# EAGLE design SXEGS (EAGLE 7.7.0)
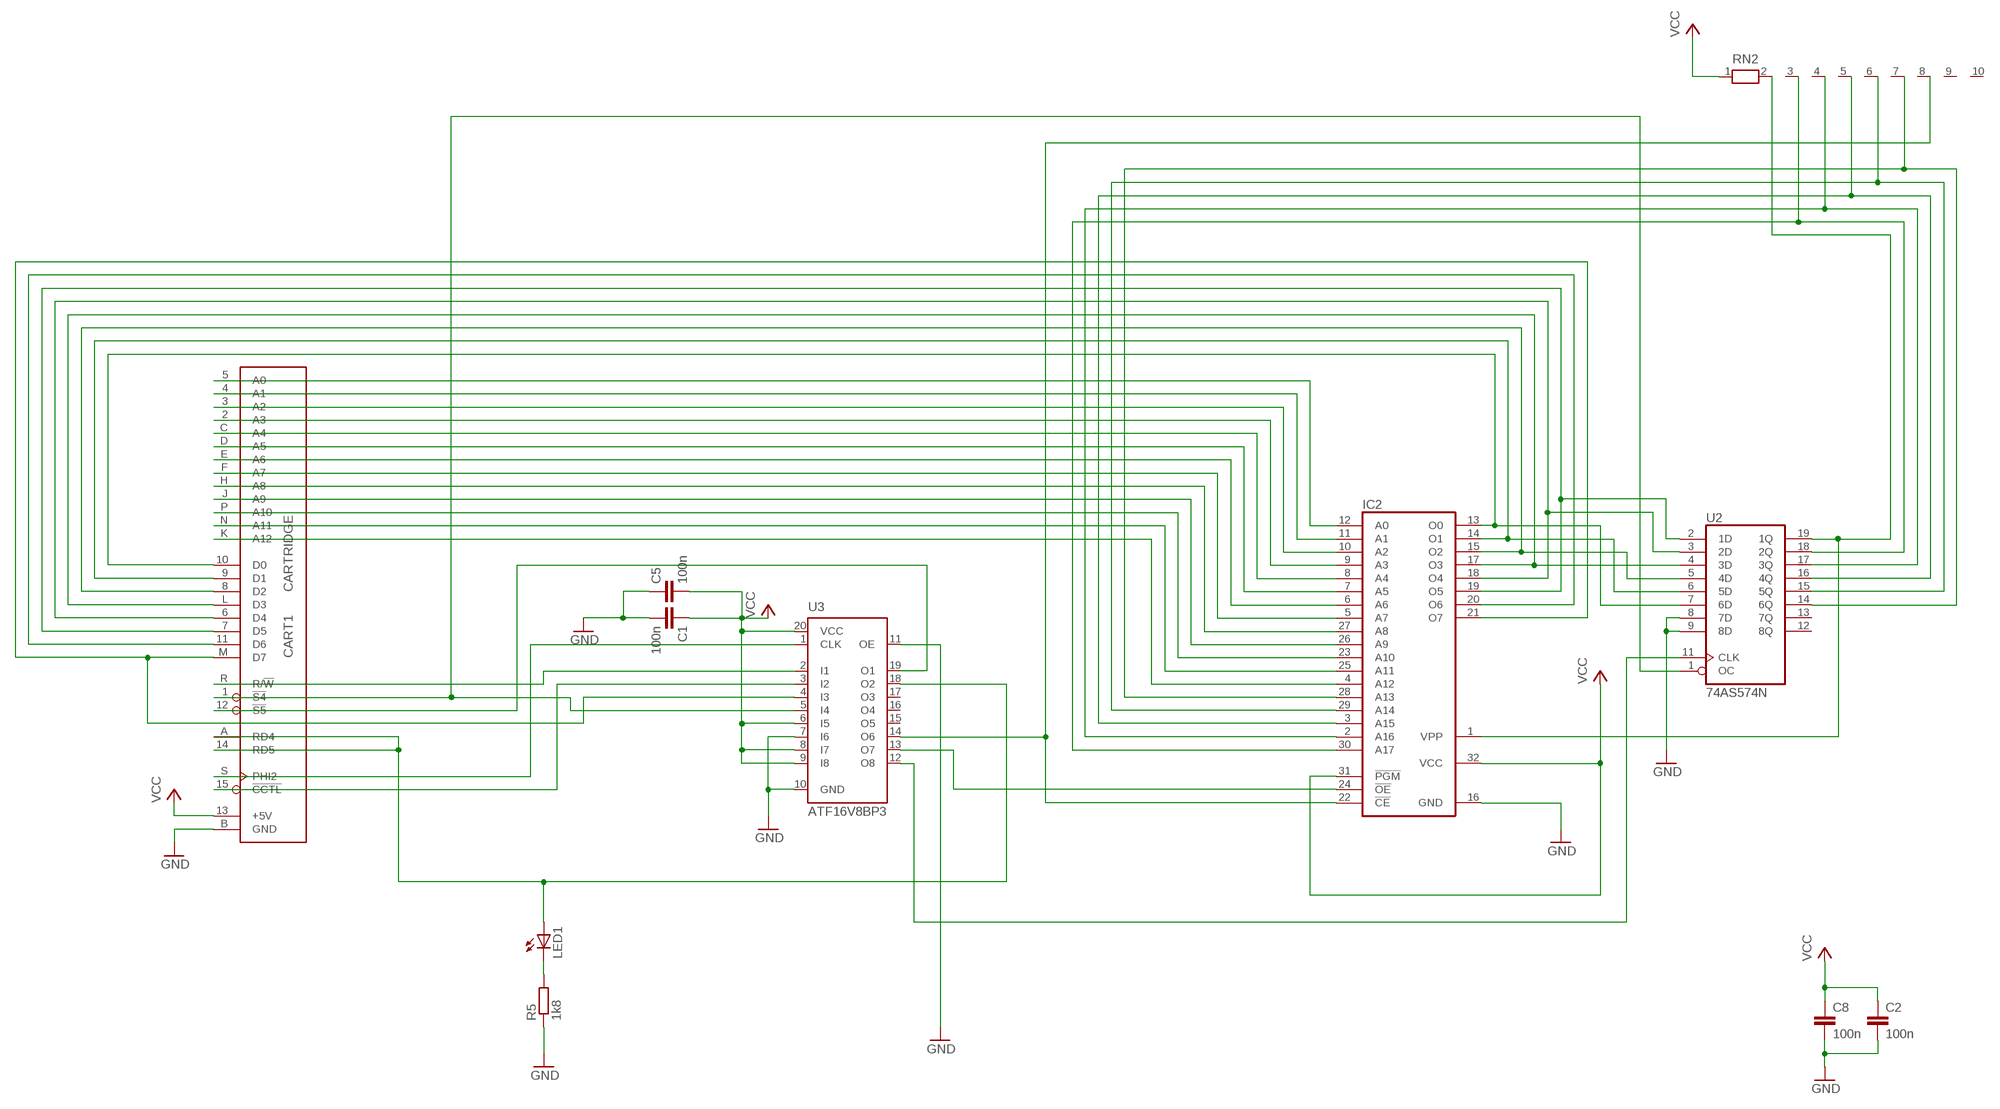
[diagram p0: schematic, sheet 1]

## Parts
C1  100n  C-EU050-024X044  [C050-024X044]
C2  100n  C-EUC0805  [C0805]
C5  100n  C-EUC0805  [C0805]
C8  100n  C-EUC0805  [C0805]
CART1  CARTRIDGE  [CARTRIDGE]
IC2  27C2001D  [DIL32]
LED1  LEDCHIP-LED0805  [CHIP-LED0805]
R5  1k8  R-EU_R0805  [R0805]
RN2  RN09  [RN-10]
U2  74AS574N  [DIL20]
U3  ATF16V8BP3  [DIL20]

## Nets
GND: C1.2 C2.2 C5.1 C8.2 CART1.B(GND) IC2.16(GND) R5.1 U2.8(7D) U2.9(8D) U3.7(I6) U3.10(GND) U3.11(OE)
N$1: LED1.C R5.2
N$3: IC2.30(A17) RN2.3 U2.18(2Q)
N$4: CART1.R(R/!W) U3.2(I1)
N$5: CART1.14(RD5) CART1.A(RD4) LED1.A U3.18(O2)
N$6: IC2.1(VPP) RN2.2 U2.19(1Q)
N$10: CART1.15(!CCTL) U3.3(I2)
N$11: CART1.S(PHI2) U3.1(CLK)
N$12: CART1.1(!S4) U2.1(OC) U3.5(I4)
N$13: CART1.12(!S5) U3.19(O1)
N$15: IC2.22(!CE) RN2.8 U3.14(O6)
N$16: IC2.24(!OE) U3.13(O7)
N$17: U2.11(CLK) U3.12(O8)
N$21: CART1.10(D0) IC2.13(O0) U2.7(6D)
N$22: CART1.9(D1) IC2.14(O1) U2.6(5D)
N$23: CART1.8(D2) IC2.15(O2) U2.5(4D)
N$24: CART1.L(D3) IC2.17(O3) U2.4(3D)
N$25: CART1.6(D4) IC2.18(O4) U2.3(2D)
N$26: CART1.7(D5) IC2.19(O5) U2.2(1D)
N$27: CART1.11(D6) IC2.20(O6)
N$28: CART1.M(D7) IC2.21(O7) U3.4(I3)
N$29: CART1.5(A0) IC2.12(A0)
N$30: CART1.4(A1) IC2.11(A1)
N$31: CART1.3(A2) IC2.10(A2)
N$32: CART1.2(A3) IC2.9(A3)
N$33: CART1.C(A4) IC2.8(A4)
N$34: CART1.D(A5) IC2.7(A5)
N$35: CART1.E(A6) IC2.6(A6)
N$36: CART1.F(A7) IC2.5(A7)
N$37: CART1.H(A8) IC2.27(A8)
N$38: CART1.J(A9) IC2.26(A9)
N$39: CART1.P(A10) IC2.23(A10)
N$40: CART1.N(A11) IC2.25(A11)
N$41: CART1.K(A12) IC2.4(A12)
N$42: IC2.28(A13) RN2.7 U2.14(6Q)
N$44: IC2.29(A14) RN2.6 U2.15(5Q)
N$45: IC2.3(A15) RN2.5 U2.16(4Q)
N$46: IC2.2(A16) RN2.4 U2.17(3Q)
VCC: C1.1 C2.1 C5.2 C8.1 CART1.13(+5V) IC2.31(!PGM) RN2.1 U3.6(I5) U3.8(I7) U3.9(I8) U3.20(VCC)
Unconnected: RN2.9 RN2.10 U2.12(8Q) U2.13(7Q) U3.15(O5) U3.16(O4) U3.17(O3)

## Power pins joined to a net without a drawn wire
GND: U2.10(GND)
VCC: IC2.32(VCC) U2.20(VCC)

## Library data of the parts
C1 = resistor:C-EU: CAPACITOR, European symbol
C2 C5 C8 = rcl:C-EU: CAPACITOR, European symbol
CART1 = Atari Corp Cartridge:CARTRIDGE: Cartridge
IC2 = memory-nec:27C2001D: MEMORY; MPN: M27C2001-10B1; OC_FARNELL: 3338101; OC_NEWARK: 37M4702
LED1 = led:LED: LED OSRAM: - CHIPLED LG R971, LG N971, LY N971, LG Q971, LY Q971, LO R971, LY R971 LH N974, LH R974 LS Q976, LO Q976, LY Q976 LO Q996 - Hyper CHIPLED LW Q18S LB Q993, LB Q99A, LB R99A - SideLED LS A670, LO A670, LY A670, LG A670, LP A670 LB A673, LV A673, LT A673, LW A673 LH A674 LY A675 LS A676, LA A676, LO A676, LY A676, LW A676 LS A679, LY A679, LG A679 - Hyper Micro SIDELED® LS Y876, LA Y876, LO Y876, LY Y876 LT Y87S - SmartLED LW L88C, LW L88S LB L89C, LB L89S, LG L890 LS L89K, LO L89K, LY L89K LS L896, LA L896, LO L896, LY L896 - TOPLED LS T670, LO T670, LY T670, LG T670, LP T670 LSG T670, LSP T670, LSY T670, LOP T670, LYG T670 LG T671, LOG T671, LSG T671 LB T673, LV T673, LT T673, LW T673 LH T674 LS T676, LA T676, LO T676, LY T676, LB T676, LH T676, LSB T676, LW T676 LB T67C, LV T67C, LT T67C, LS T67K, LO T67K, LY T67K, LW E67C LS E67B, LA E67B, LO E67B, LY E67B, LB E67C, LV E67C, LT E67C LW T67C LS T679, LY T679, LG T679 LS T770, LO T770, LY T770, LG T770, LP T770 LB T773, LV T773, LT T773, LW T773 LH T774 LS E675, LA E675, LY E675, LS T675 LS T776, LA T776, LO T776, LY T776, LB T776 LHGB T686 LT T68C, LB T68C - Hyper Mini TOPLED® LB M676 - Mini TOPLED Santana® LG M470 LS M47K, LO M47K, LY M47K Source: http://www.osram.convergy.de LUXEON: - LUMILED® LXK2-PW12-R00, LXK2-PW12-S00, LXK2-PW14-U00, LXK2-PW14-V00 LXK2-PM12-R00, LXK2-PM12-S00, LXK2-PM14-U00 LXK2-PE12-Q00, LXK2-PE12-R00, LXK2-PE12-S00, LXK2-PE14-T00, LXK2-PE14-U00 LXK2-PB12-K00, LXK2-PB12-L00, LXK2-PB12-M00, LXK2-PB14-N00, LXK2-PB14-P00, LXK2-PB14-Q00 LXK2-PR12-L00, LXK2-PR12-M00, LXK2-PR14-Q00, LXK2-PR14-R00 LXK2-PD12-Q00, LXK2-PD12-R00, LXK2-PD12-S00 LXK2-PH12-R00, LXK2-PH12-S00 LXK2-PL12-P00, LXK2-PL12-Q00, LXK2-PL12-R00 Source: www.luxeon.com KINGBRIGHT: KA-3528ASYC Source: www.kingbright.com
R5 = rcl:R-EU_: RESISTOR, European symbol
RN2 = resistor-net:RN09: RESISTOR NETWORK; OC_FARNELL: unknown; OC_NEWARK: unknown
U2 = 74xx-eu:74*574: 8-bit D type FLIP FLOP bus driver
U3 = atmel:ATF16V8B: High perfomance CMOS (electrically erasable) programmable logic device (PLD) ABLE-Atmel-ABEL - P18V8R, P16V8C, P16V8AS, P17V8 COPL Atmel-WinCUPL - G16V8MS, G16V8MA, G16V8AS, G16V8 LOG/IC - GAL16V8_R, GAL16V8_G7, GAL16V8_C), GAL16V8 Tango-PLD - G16V8R, G16V8C, G16V8AS, G16V8 Source: http://www.atmel.com/dyn/resources/prod_documents/DOC0364.PDF; MPN: ATF16V8CZ-15PU; OC_FARNELL: 1551768; OC_NEWARK: 94M6254

## Board
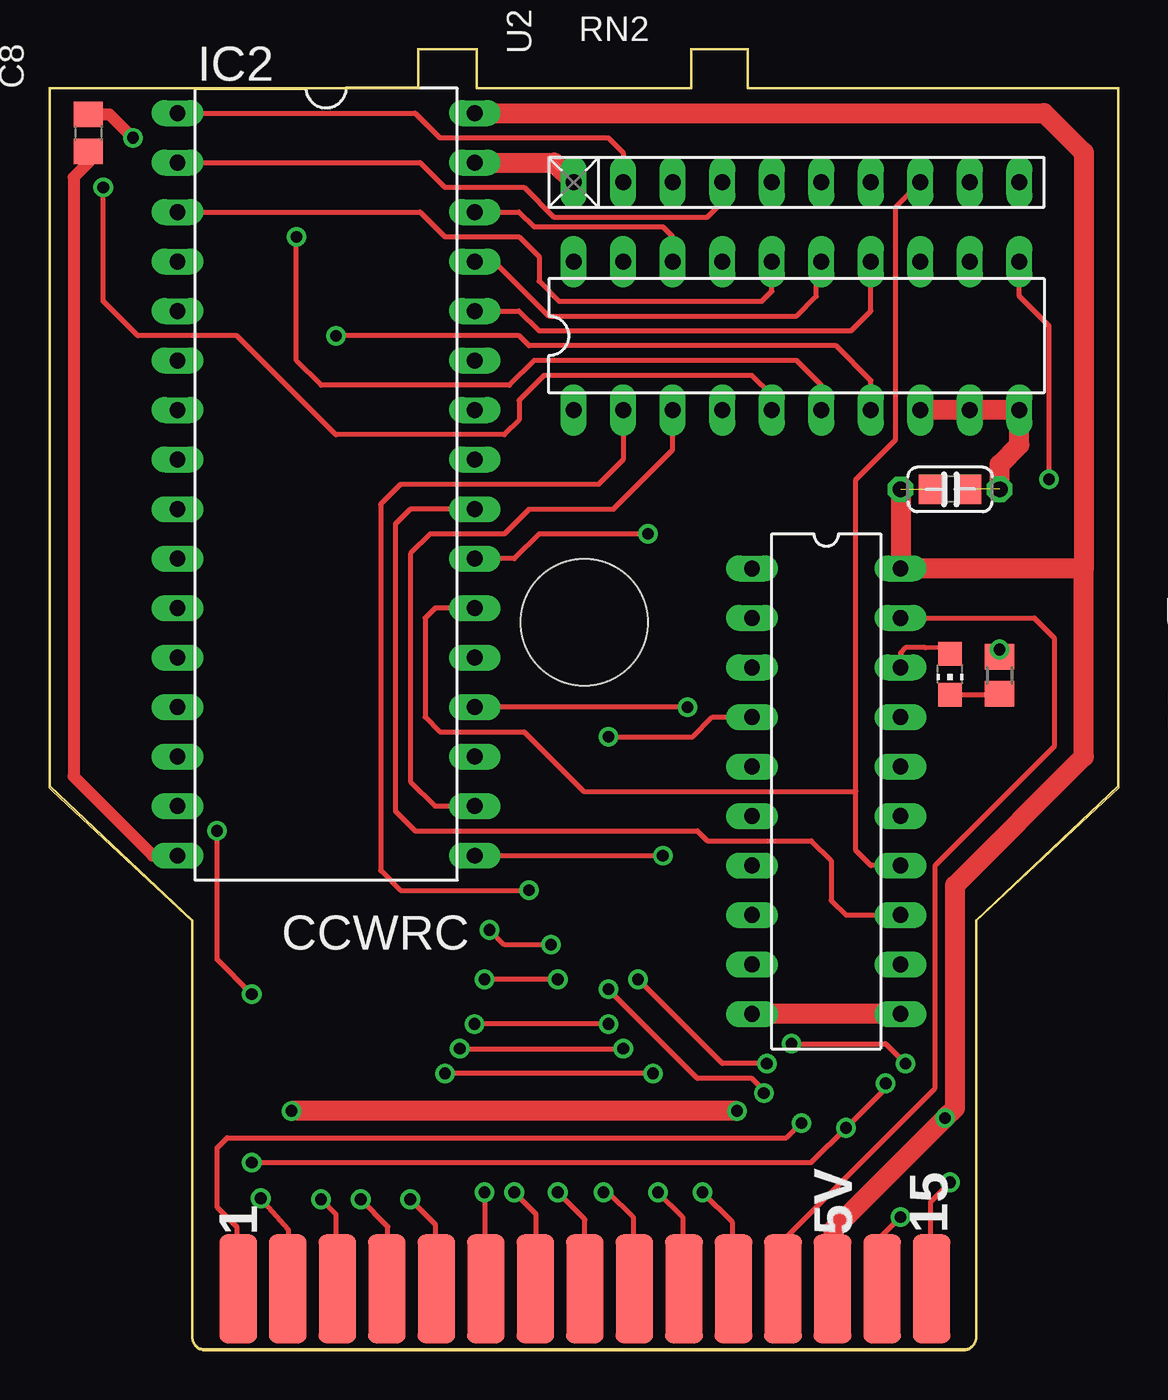
[diagram p1: board, top side]
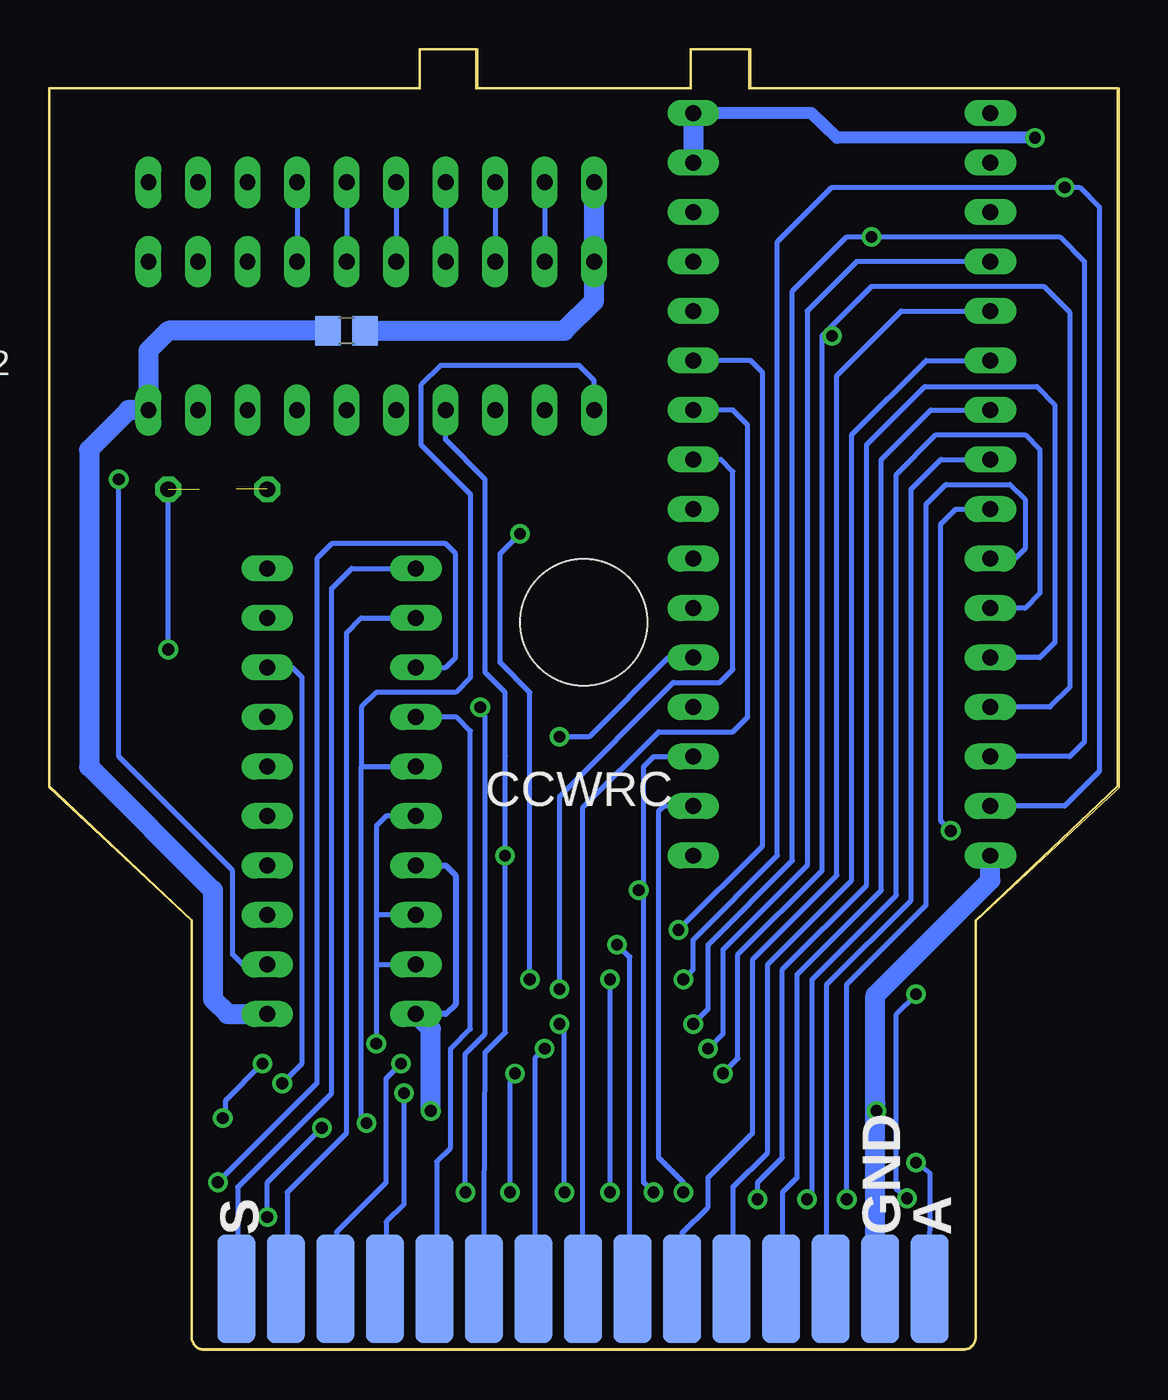
[diagram p2: board, bottom side, seen from below]

Size 54.9 x 66.8 mm. Coordinates in mm from the lower left corner, seen from the top.
Outline: 8.02,0 46.94,0 arc90 47.55,0.56 47.55,22.04 54.9,28.9 54.9,64.8 35.9,64.8 35.9,66.8 32.9,66.8 32.9,64.8 22,64.8 22,66.8 18.9,66.8 18.9,64.8 0,64.8 0,28.91 0.15,28.75 7.35,22.02 7.35,0.61 arc90 8.02,0
Copper layers (1*16): Top 0.035mm / dielectric 1.5mm / Bottom 0.035mm
Design rules "default": minimum track width 10mil, minimum drill 24mil, track to track 8mil, track to pad 8mil, pad to pad 8mil, via to via 8mil, smd to smd 8mil, copper to edge 40mil, drill to drill 8mil, minimum pad ring 10mil, minimum via ring 8mil, stop-mask expansion 4mil, vias tented up to drill 0mil, thermal gap 10mil

### Footprints (pad centres in the part's own frame; a part is rotated, then mirrored left to right if it is on the bottom)
C050-024X044 = drill 0.813 octagon: 1 -2.54,0; 2 2.54,0
C0805 = smd 1.3 x 1.5: 1 -0.95,0; 2 0.95,0
CARTRIDGE = smd 1.93 x 5.588: 1 45.144,63.595; 2 42.604,63.595; 3 40.064,63.595; 4 37.524,63.595; 5 34.984,63.595; 6 32.444,63.595; 7 29.904,63.595; 8 27.364,63.595; 9 24.824,63.595; 10 22.284,63.595; 11 19.744,63.595; 12 17.204,63.595; 13 14.664,63.595; 14 12.124,63.595; 15 9.584,63.595 | smd 1.93 x 5.588 bottom: A 45.144,63.595; B 42.604,63.595; C 40.064,63.595; D 37.524,63.595; E 34.984,63.595; F 32.444,63.595; H 29.904,63.595; J 27.364,63.595; K 24.824,63.595; L 22.284,63.595; M 19.744,63.595; N 17.204,63.595; P 14.664,63.595; R 12.124,63.595; S 9.584,63.595 | hole 6.5: 27.4,29.4
DIL32 = drill 0.813 long: 1 -19.05,-7.62; 2 -16.51,-7.62; 3 -13.97,-7.62; 4 -11.43,-7.62; 5 -8.89,-7.62; 6 -6.35,-7.62; 7 -3.81,-7.62; 8 -1.27,-7.62; 9 1.27,-7.62; 10 3.81,-7.62; 11 6.35,-7.62; 12 8.89,-7.62; 13 11.43,-7.62; 14 13.97,-7.62; 15 16.51,-7.62; 16 19.05,-7.62; 17 19.05,7.62; 18 16.51,7.62; 19 13.97,7.62; 20 11.43,7.62; 21 8.89,7.62; 22 6.35,7.62; 23 3.81,7.62; 24 1.27,7.62; 25 -1.27,7.62; 26 -3.81,7.62; 27 -6.35,7.62; 28 -8.89,7.62; 29 -11.43,7.62; 30 -13.97,7.62; 31 -16.51,7.62; 32 -19.05,7.62
CHIP-LED0805 = smd 1.2 x 1.2: A 0,-1.05; C 0,1.05
R0805 = smd 1.3 x 1.5: 1 -0.95,0; 2 0.95,0
RN-10 = drill 0.813 long: 1 -11.43,0; 2 -8.89,0; 3 -6.35,0; 4 -3.81,0; 5 -1.27,0; 6 1.27,0; 7 3.81,0; 8 6.35,0; 9 8.89,0; 10 11.43,0
DIL20 = drill 0.813 long: 1 -11.43,-3.81; 2 -8.89,-3.81; 3 -6.35,-3.81; 4 -3.81,-3.81; 5 -1.27,-3.81; 6 1.27,-3.81; 7 3.81,-3.81; 8 6.35,-3.81; 9 8.89,-3.81; 10 11.43,-3.81; 11 11.43,3.81; 12 8.89,3.81; 13 6.35,3.81; 14 3.81,3.81; 15 1.27,3.81; 16 -1.27,3.81; 17 -3.81,3.81; 18 -6.35,3.81; 19 -8.89,3.81; 20 -11.43,3.81

### Placement (x,y rotation side)
C1  46.23,44.2 0 top
C2  39.62,52.32 180 bottom
C5  46.23,44.2 180 top
C8  2.03,62.48 270 top
CART1  54.86,66.77 180 top
IC2  14.22,44.45 270 top
LED1  46.23,34.71 180 top
R5  48.77,34.65 270 top
RN2  38.35,59.94 0 top
U2  38.35,52.07 0 top
U3  39.88,28.7 270 top

### Tracks (layer width: path | path; a pad name or v marks a point on that pad's centre or on a via)
GND  (via drill 0.6)  (1 unrouted)
  Top 0.254: R5.1 v48.77,35.98
  Top 0.61: C8.2 2.03,60.96 1.27,60.2 1.27,29.46 5.33,25.4 IC2.16
  Top 1.016: v35.31,12.3 v12.45,12.3 | U3.11 U3.10 | U2.8 U2.9 U2.10 49.78,46.48 48.77,45.47 C1.2
  Bottom 0.254: v48.77,35.98 C1.2
  Bottom 0.305: U3.7 34.54,24.89 34.04,24.38 34.04,17.78 34.54,17.27 U3.10
  Bottom 0.813: v12.45,12.3 12.5,12.7
  Bottom 1.016: CART1.B 12.5,4.7 12.5,12.7 | 12.5,12.7 | 12.5,12.7 12.5,18.23 6.6,24.13 IC2.16 | U3.11 45.72,17.27 46.48,18.03 46.48,23.62 52.83,29.97 52.83,46.23 50.8,48.26 U2.10 49.78,51.31 48.77,52.32 C2.2 | v35.31,12.3 35.31,16.51 U3.10
N$1
  Top 0.254: LED1.C 48.61,33.66 R5.2
N$3
  Top 0.254: IC2.30 24.13,58.42 24.89,57.66 31.5,57.66 32,57.15 U2.18
  Bottom 0.254: RN2.3 U2.18
N$4
  Bottom 0.254: U3.2 38.86,37.59 39.62,36.83 39.62,11.18 42.67,8.13 42.67,3.08 CART1.R
N$5  (via drill 0.6)
  Top 0.254: v10.41,9.65 39.12,9.65 v40.89,11.43 42.93,13.46 v42.93,13.72 | 42.67,3.18 CART1.14 42.67,3.08 42.67,5.84 v43.69,6.86 | LED1.A 45.95,36.06 44.96,36.07 43.94,36.07 43.69,35.81 U3.18
  Bottom 0.254: CART1.A 9.7,9.1 v10.41,9.65 | v43.69,6.86 43.69,8.64 v40.89,11.43 | v42.93,13.72 41.91,14.73 41.91,34.54 42.42,35.05 U3.18
N$6
  Top 0.254: IC2.1 18.8,63.5 20.07,62.23 28.7,62.23 29.46,61.47 RN2.2
  Bottom 0.254: RN2.2 U2.19
N$10  (via drill 0.6)
  Top 0.254: 44.96,3.05 CART1.15 45.21,3.08 45.21,7.62 v46.23,8.64
  Bottom 0.254: U3.3 34.54,35.05 34.04,35.56 34.04,40.89 34.54,41.4 40.39,41.4 41.15,40.64 41.15,13.72 v46.23,8.64
N$11
  Bottom 0.254: U3.1 39.37,40.13 40.39,39.12 40.39,13.21 45.21,8.38 45.21,3.08 CART1.S
N$12  (via drill 0.6)
  Top 0.254: v38.61,11.68 37.85,10.92 9.14,10.92 8.64,10.41 8.64,7.37 9.65,6.35 9.65,3.08 CART1.1
  Bottom 0.254: v38.61,11.68 38.86,11.94 38.86,29.97 | 38.86,29.97 U3.5 | U2.1 26.92,49.78 27.69,50.55 34.8,50.55 35.81,49.53 35.81,46.48 33.27,43.94 33.27,34.54 34.04,33.78 38.1,33.78 38.86,33.02 38.86,29.97
N$13
  Top 0.254: U3.19 50.55,37.59 51.56,36.58 51.56,30.99 45.47,24.89 45.47,13.46 37.59,5.59 37.59,3.08 CART1.12
N$15
  Top 0.254: IC2.22 19.81,38.1 19.3,37.59 19.3,32.51 20.07,31.75 24.38,31.75 27.43,28.7 41.4,28.7 | U3.14 42.16,24.89 41.4,25.65 41.4,28.7 | 41.4,28.7 41.4,44.7 43.43,46.74 43.43,58.67 RN2.8
N$16
  Top 0.254: IC2.24 18.54,43.18 17.78,42.42 17.78,27.69 18.8,26.67 33.27,26.67 33.78,26.16 39.12,26.16 40.13,25.15 40.13,23.11 40.89,22.35 U3.13
N$17  (via drill 0.6)
  Top 0.254: v51.31,44.7 51.31,52.58 49.78,54.1 U2.11
  Bottom 0.254: U3.12 44.96,19.81 45.47,20.32 45.47,24.64 51.31,30.48 v51.31,44.7
N$21  (via drill 0.6)
  Top 0.254: v30.99,14.22 v20.32,14.22 | U2.7 42.16,49.78 40.39,51.56 24.64,51.56 24.13,52.07 v14.73,52.07 | v31.24,8.13 32.51,6.86 32.51,3.08 CART1.10
  Bottom 0.254: v31.24,8.13 31.24,13.72 v30.99,14.22 | v20.32,14.22 19.56,14.99 19.56,20.32 15.24,24.64 15.24,51.82 | 15.24,51.82 15.24,52.07 12.7,54.61 3.87,54.61 2.54,53.28 2.54,34.04 3.56,33.02 IC2.13 | v14.73,52.07 14.99,52.07 15.24,51.82
N$22  (via drill 0.6)
  Top 0.254: v28.7,16.76 v21.84,16.76 | U2.6 39.62,49.53 38.35,50.8 24.89,50.8 23.62,49.53 13.97,49.53 12.7,50.8 v12.7,57.15 | v28.45,8.13 28.7,8.13 29.97,6.86 29.97,3.08 CART1.9
  Bottom 0.254: v28.45,8.13 28.45,16.51 v28.7,16.76 | v21.84,16.76 21.08,17.53 21.08,20.83 16.76,25.15 16.76,54.36 13.97,57.15 v12.7,57.15 3.05,57.15 1.78,55.88 1.78,31.24 2.54,30.48 IC2.14
N$23  (via drill 0.6)
  Top 0.254: CART1.8 27.5,6.74 v26.11,8.13 | v26.11,19.05 v22.35,19.05 | U2.5 37.08,49.02 36.07,50.04 25.4,50.04 24.13,48.77 24.13,47.75 23.37,46.99 14.73,46.99 9.65,52.07 4.57,52.07 2.79,53.85 v2.79,59.69
  Bottom 0.254: v26.11,8.13 v26.11,19.05 | v22.35,19.05 21.84,19.56 21.84,21.08 17.53,25.4 17.53,56.9 14.73,59.69 v2.79,59.69 2.03,59.69 1.02,58.67 1.02,29.72 2.79,27.94 IC2.15
N$24  (via drill 0.6)
  Top 0.254: IC2.17 v31.5,25.4
  Bottom 0.254: CART1.L 32.51,15.29 31.48,16.32 31.48,25.4 | 31.48,25.4 31.48,30.49 31.5,31.24 31.5,33.78 32.51,34.8 32.51,44.7 34.54,46.74 U2.4 | v31.5,25.4 31.48,25.4
N$25  (via drill 0.6)
  Top 0.254: CART1.6 22.4,7.7 22.4,7.98 22.5,7.98 v22.35,8.13 | IC2.18 19.81,27.94 18.54,29.21 18.54,40.89 19.56,41.91 23.37,41.91 24.64,43.18 28.96,43.18 32,46.23 U2.3
  Bottom 0.254: v22.35,8.13 22.35,8.64 23.62,9.91 23.62,27.69 23.37,27.94 IC2.18
N$26  (via drill 0.6)
  Top 0.254: CART1.7 25,4.1 25,7 | 25,7 | 25,7 v23.88,8.13 | U2.2 29.46,45.72 28.19,44.45 18.03,44.45 17.02,43.43 17.02,24.64 18.03,23.62 v24.64,23.62
  Bottom 0.254: v23.88,8.13 24.38,8.64 24.38,23.62 | 24.38,23.62 24.38,29.97 23.88,30.48 IC2.19 | v24.64,23.62 24.38,23.62
N$27  (via drill 0.6)
  Top 0.254: v32.77,33.02 IC2.20 | v33.53,8.13 35.05,6.6 35.05,3.08 CART1.11
  Bottom 0.254: v33.53,8.13 33.53,15.24 32.51,16.26 32.51,32.51 v32.77,33.02
N$28  (via drill 0.6)
  Top 0.254: v28.7,31.5 33.02,31.5 34.04,32.51 U3.4
  Bottom 0.254: U3.4 33.98,32.51 33.27,31.8 33.27,16.51 34.29,15.49 34.29,10.41 35,9.7 35,3.13 CART1.M | IC2.21 23.11,35.56 27.18,31.5 v28.7,31.5
N$29  (via drill 0.6)
  Top 0.254: v18.54,7.77 19.81,6.5 19.81,3.08 CART1.5
  Bottom 0.254: v18.54,7.77 18.54,8.64 17.27,9.91 17.27,19.56 12.95,23.88 12.95,46.48 9.96,49.48 4.22,49.48 3.3,48.51 3.3,36.32 4.06,35.56 IC2.12
N$30  (via drill 0.6)
  Top 0.254: CART1.4 17.4,6.37 v16,7.77
  Bottom 0.254: v16,7.77 15.75,7.62 15.75,19.05 11.43,23.37 11.43,44.96 9.4,46.99 4.83,46.99 4.06,46.23 4.06,38.86 4.83,38.1 IC2.11
N$31  (via drill 0.6)
  Top 0.254: v13.97,7.77 14.73,7 14.73,3.08 CART1.3
  Bottom 0.254: v13.97,7.77 13.97,18.8 9.91,22.86 9.91,43.43 8.89,44.45 5.59,44.45 4.83,43.69 4.83,41.15 5.33,40.64 IC2.10
N$32  (via drill 0.6)
  Top 0.254: CART1.2 12.3,6.2 v10.88,7.82 | v10.41,18.29 8.64,20.07 v8.64,26.67
  Bottom 0.254: v10.88,7.82 11.43,8.27 11.43,17.27 v10.41,18.29 | v8.64,26.67 9.14,27.18 9.14,42.42 8.38,43.18 IC2.9
N$33
  Bottom 0.254: CART1.C 15,3.01 15,4.6 15,18.78 10.67,23.11 10.67,44.2 9.14,45.72 IC2.8
N$34
  Bottom 0.254: IC2.7 9.65,48.26 12.19,45.72 12.19,23.62 16.51,19.3 16.51,8.89 17.27,8.13 17.27,3.08 CART1.D
N$35
  Bottom 0.254: IC2.6 9.91,50.8 13.72,46.99 13.72,24.13 18.03,19.81 18.03,10.16 19.81,8.38 19.81,3.08 CART1.E
N$36
  Bottom 0.254: IC2.5 11.18,53.34 14.48,50.04 14.48,24.38 18.8,20.07 18.8,11.18 21.08,8.89 21.08,7.37 22.4,6.05 22.42,6.05 CART1.F
N$37  (via drill 0.6)
  Top 0.254: v25.75,20.83 23.37,20.83 v22.61,21.59
  Bottom 0.254: CART1.H 25,3.01 25.1,3.1 25.1,20.21 25.14,20.21 v25.75,20.83 | IC2.27 18.9,50.8 18.29,50.19 18.29,25.91 v22.61,21.59
N$38
  Bottom 0.254: CART1.J 27.5,27.87 23.62,31.75 19.81,31.75 19.05,32.51 19.05,47.5 19.81,48.26 IC2.26
N$39  (via drill 0.6)
  Top 0.254: v36.83,14.73 34.54,14.73 v30.23,19.05 | v30.73,41.91 25.15,41.91 23.88,40.64 IC2.23
  Bottom 0.254: v36.83,14.73 37.59,13.97 37.59,8.64 40.13,6.1 40.13,3.08 CART1.P | v30.23,19.05 30.23,33.78 31.75,35.31 31.75,40.89 v30.73,41.91
N$40  (via drill 0.6)
  Top 0.254: v36.68,13.21 36.58,13.46 36.07,13.97 33.27,13.97 v28.7,18.54
  Bottom 0.254: v28.7,18.54 28.7,28.45 22.86,34.29 20.47,34.29 19.81,34.95 19.81,45.11 20.42,45.72 IC2.25 | v36.68,13.21 36.68,7.52 37.59,6.6 37.59,3.08 CART1.N
N$41  (via drill 0.6)
  Top 0.254: v21.08,15.49 v29.46,15.49
  Bottom 0.254: IC2.4 13.46,55.88 16,53.34 16,24.89 20.32,20.57 20.32,16.26 v21.08,15.49 | v29.46,15.49 29.97,14.99 29.97,3.04 CART1.K
N$42
  Top 0.254: IC2.28 24.13,53.34 25.15,52.32 41.15,52.32 42.16,53.34 U2.14
  Bottom 0.254: RN2.7 U2.14
N$44
  Top 0.254: IC2.29 22.86,55.88 25.65,53.09 38.35,53.09 39.37,54.1 39.37,55.63 U2.15
  Bottom 0.254: RN2.6 U2.15
N$45
  Top 0.254: IC2.3 19.05,58.42 20.32,57.15 24.13,57.15 25.15,56.13 25.15,54.86 26.16,53.85 36.58,53.85 37.08,54.36 U2.16
  Bottom 0.254: RN2.5 U2.16
N$46
  Top 0.254: IC2.2 19.05,60.96 20.32,59.69 24.38,59.69 25.91,58.17 33.78,58.17 34.54,58.93 RN2.4
  Bottom 0.254: RN2.4 U2.17
VCC  (via drill 0.6)  (1 unrouted)
  Top 0.254: v38.1,15.75 42.93,15.75 v43.94,14.73
  Top 0.61: C8.1 3.11,63.43 v4.32,62.23
  Top 1.016: IC2.31 25.91,60.96 RN2.1 | CART1.13 40.25,6.22 v45.97,11.94 46.48,12.45 46.48,23.88 53.09,30.48 53.09,40.13 | 53.09,40.13 U3.20 C1.1 | IC2.32 51.05,63.5 53.09,61.47 53.09,40.13
  Bottom 0.254: U3.6 37.59,27.43 38.1,26.92 38.1,22.35 | 38.1,22.35 38.1,19.81 | 38.1,19.81 U3.9 | U3.8 38.1,22.35 | 38.1,19.81 v38.1,15.75 | v43.94,14.73 45.85,12.83 45.85,12.06 v45.97,11.94
  Bottom 0.61: RN2.1 U2.20 | v4.32,62.23 14.48,62.23 15.79,63.5 IC2.32
  Bottom 1.016: IC2.32 IC2.31 | 26.92,59.18 U2.20 26.92,53.85 28.45,52.32 C2.1

### Text on the board
tNames: CCWRC
bNames: CCWRC